# EAGLE schematic ME433Schematic (EAGLE 7.5.0)
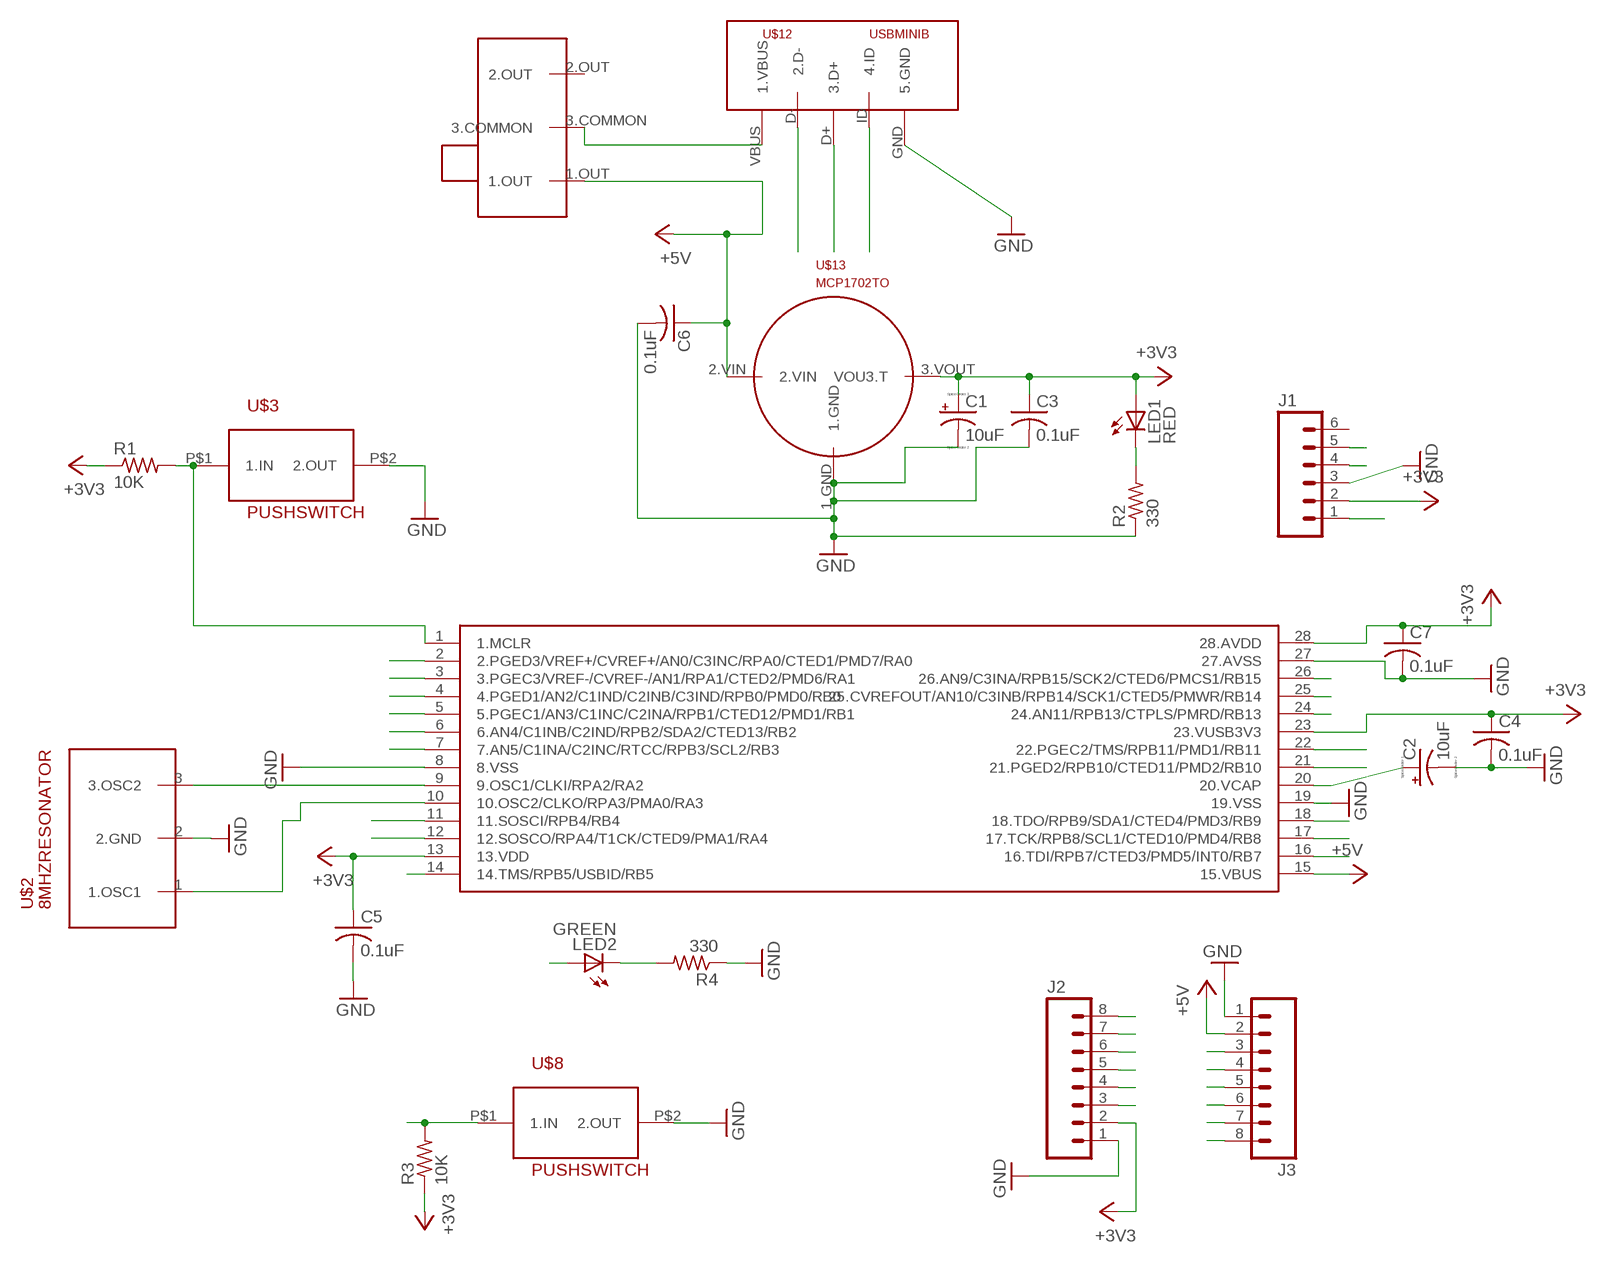
[diagram p0: schematic, sheet 1]

## Parts
C1  10uF  CPOL-USB45181B  [B45181B]
C2  10uF  CPOL-USB45181B  [B45181B]
C3  0.1uF  C-US025-025X050  [C025-025X050]
C4  0.1uF  C-US025-025X050  [C025-025X050]
C5  0.1uF  C-US025-025X050  [C025-025X050]
C6  0.1uF  C-US025-025X050  [C025-025X050]
C7  0.1uF  C-US025-030X050  [C025-030X050]
J1  M06SILK_FEMALE_PTH  [1X06]
J2  M08  [1X08_ROUND]
J3  M08  [1X08_ROUND]
LED1  RED  LED3MM  [LED3MM]
LED2  GREEN  LED3MM  [LED3MM]
R1  10K  R-US_0207/10  [0207/10]
R2  330  R-US_0207/10  [0207/10]
R3  10K  R-US_0207/10  [0207/10]
R4  330  R-US_0207/10  [0207/10]
U$1  PIC32MX250F128B  [DIL28-3]
U$2  8MHZRESONATOR  [1X03]
U$3  PUSHSWITCH  [SWITCH]
U$8  PUSHSWITCH  [SWITCH]
U$12  USBMINIB  [USB-MB-H]
U$13  MCP1702TO  [TO92]
U$18  SLIDESWITCH  [SPDTSLIDE]

## Nets
+3V3: C1.+ C3.1 C4.1 C5.1 C7.1 J1.2 J2.2 LED1.A(1.+) R1.1 R3.1 U$1.13(13.VDD) U$1.23(23.VUSB3V3) U$1.28(28.AVDD) U$13.3.VOUT(VOU3.T)
+5V: C6.1 J3.2 U$1.15(15.VBUS) U$13.2.VIN U$18.1.OUT
A0: J2.8 U$1.2(2.PGED3/VREF+/CVREF+/AN0/C3INC/RPA0/CTED1/PMD7/RA0)
A1: J2.7 U$1.3(3.PGEC3/VREF-/CVREF-/AN1/RPA1/CTED2/PMD6/RA1)
A4: J2.3 LED2.A(1.+) U$1.12(12.SOSCO/RPA4/T1CK/CTED9/PMA1/RA4)
B2: J2.6 U$1.6(6.AN4/C1INB/C2IND/RPB2/SDA2/CTED13/RB2)
B3: J2.5 U$1.7(7.AN5/C1INA/C2INC/RTCC/RPB3/SCL2/RB3)
B4: J2.4 R3.2 U$1.11(11.SOSCI/RPB4/RB4) U$8.P$1(1.IN)
B7: J3.3 U$1.16(16.TDI/RPB7/CTED3/PMD5/INT0/RB7)
B8: J3.4 U$1.17(17.TCK/RPB8/SCL1/CTED10/PMD4/RB8)
B9: J3.5 U$1.18(18.TDO/RPB9/SDA1/CTED4/PMD3/RB9)
B13: J3.6 U$1.24(24.AN11/RPB13/CTPLS/PMRD/RB13)
B14: J3.7 U$1.25(25.CVREFOUT/AN10/C3INB/RPB14/SCK1/CTED5/PMWR/RB14)
B15: J3.8 U$1.26(26.AN9/C3INA/RPB15/SCK2/CTED6/PMCS1/RB15)
D+: U$1.21(21.PGED2/RPB10/CTED11/PMD2/RB10) U$12.D+(3.D+)
D-: U$1.22(22.PGEC2/TMS/RPB11/PMD1/RB11) U$12.D-(2.D-)
GND: C1.- C2.- C3.2 C4.2 C5.2 C6.2 C7.2 J1.3 J2.1 J3.1 R2.1 R4.1 U$1.8(8.VSS) U$1.19(19.VSS) U$1.27(27.AVSS) U$2.2(2.GND) U$3.P$2(2.OUT) U$8.P$2(2.OUT) U$12.GND(5.GND) U$13.1.GND
ID: U$1.14(14.TMS/RPB5/USBID/RB5) U$12.ID(4.ID)
MCLR: J1.1 R1.2 U$1.1(1.MCLR) U$3.P$1(1.IN)
N$1: U$12.VBUS(1.VBUS) U$18.3.COMMON
N$2: U$1.9(9.OSC1/CLKI/RPA2/RA2) U$2.3(3.OSC2)
N$3: U$1.10(10.OSC2/CLKO/RPA3/PMA0/RA3) U$2.1(1.OSC1)
N$6: C2.+ U$1.20(20.VCAP)
N$7: LED2.K(2.-) R4.2
N$11: LED1.K(2.-) R2.2
PEGC1: J1.5 U$1.5(5.PGEC1/AN3/C1INC/C2INA/RPB1/CTED12/PMD1/RB1)
PEGD1: J1.4 U$1.4(4.PGED1/AN2/C1IND/C2INB/C3IND/RPB0/PMD0/RB0)
Unconnected: J1.6 U$18.2.OUT

## Library data of the parts
C1 C2 = ME433Library:CPOL-US: POLARIZED CAPACITOR, American symbol
C3-C7 = ME433Library:C-US: CAPACITOR, American symbol
J1 = ME433Library:M06: Header 6 Standard 6-pin 0.1" header. Use with straight break away headers (SKU : PRT-00116), right angle break away headers (PRT-00553), swiss pins (PRT-00743), machine pins (PRT-00117), and female headers (PRT-00115). Molex polarized connector foot print use with SKU : PRT-08094 with associated crimp pins and housings. NOTES ON THE VARIANTS LOCK and LOCK_LONGPADS... This footprint was designed to help hold the alignment of a through-hole component (i.e. 6-pin header) while soldering it into place. You may notice that each hole has been shifted either up or down by 0.005 of an inch from it's more standard position (which is a perfectly straight line). This slight alteration caused the pins (the squares in the middle) to touch the edges of the holes. Because they are alternating, it causes a "brace" to hold the component in place. 0.005 has proven to be the perfect amount of "off-center" position when using our standard breakaway headers. Although looks a little odd when you look at the bare footprint, once you have a header in there, the alteration is very hard to notice. Also,if you push a header all the way into place, it is covered up entirely on the bottom side. This idea of altering the position of holes to aid alignment will be further integrated into the Sparkfun Library for other footprints. It can help hold any component with 3 or more connection pins.; PROD_ID: CONN-08437
J2 J3 = ME433Library:M08: Header 8 Standard 8-pin 0.1" header. Use with straight break away headers (SKU : PRT-00116), right angle break away headers (PRT-00553), swiss pins (PRT-00743), machine pins (PRT-00117), and female headers (PRT-00115).; PROD_ID: CONN-08437
LED1 LED2 = ME433Library:LED: LED OSRAM: - CHIPLED LG R971, LG N971, LY N971, LG Q971, LY Q971, LO R971, LY R971 LH N974, LH R974 LS Q976, LO Q976, LY Q976 LO Q996 - Hyper CHIPLED LW Q18S LB Q993, LB Q99A, LB R99A - SideLED LS A670, LO A670, LY A670, LG A670, LP A670 LB A673, LV A673, LT A673, LW A673 LH A674 LY A675 LS A676, LA A676, LO A676, LY A676, LW A676 LS A679, LY A679, LG A679 - Hyper Micro SIDELED® LS Y876, LA Y876, LO Y876, LY Y876 LT Y87S - SmartLED LW L88C, LW L88S LB L89C, LB L89S, LG L890 LS L89K, LO L89K, LY L89K LS L896, LA L896, LO L896, LY L896 - TOPLED LS T670, LO T670, LY T670, LG T670, LP T670 LSG T670, LSP T670, LSY T670, LOP T670, LYG T670 LG T671, LOG T671, LSG T671 LB T673, LV T673, LT T673, LW T673 LH T674 LS T676, LA T676, LO T676, LY T676, LB T676, LH T676, LSB T676, LW T676 LB T67C, LV T67C, LT T67C, LS T67K, LO T67K, LY T67K, LW E67C LS E67B, LA E67B, LO E67B, LY E67B, LB E67C, LV E67C, LT E67C LW T67C LS T679, LY T679, LG T679 LS T770, LO T770, LY T770, LG T770, LP T770 LB T773, LV T773, LT T773, LW T773 LH T774 LS E675, LA E675, LY E675, LS T675 LS T776, LA T776, LO T776, LY T776, LB T776 LHGB T686 LT T68C, LB T68C - Hyper Mini TOPLED® LB M676 - Mini TOPLED Santana® LG M470 LS M47K, LO M47K, LY M47K Source: http://www.osram.convergy.de LUXEON: - LUMILED® LXK2-PW12-R00, LXK2-PW12-S00, LXK2-PW14-U00, LXK2-PW14-V00 LXK2-PM12-R00, LXK2-PM12-S00, LXK2-PM14-U00 LXK2-PE12-Q00, LXK2-PE12-R00, LXK2-PE12-S00, LXK2-PE14-T00, LXK2-PE14-U00 LXK2-PB12-K00, LXK2-PB12-L00, LXK2-PB12-M00, LXK2-PB14-N00, LXK2-PB14-P00, LXK2-PB14-Q00 LXK2-PR12-L00, LXK2-PR12-M00, LXK2-PR14-Q00, LXK2-PR14-R00 LXK2-PD12-Q00, LXK2-PD12-R00, LXK2-PD12-S00 LXK2-PH12-R00, LXK2-PH12-S00 LXK2-PL12-P00, LXK2-PL12-Q00, LXK2-PL12-R00 Source: www.luxeon.com KINGBRIGHT: KA-3528ASYC Source: www.kingbright.com
R1-R4 = ME433Library:R-US_: RESISTOR, American symbol
U$1 = ME433Library:PIC32MX250F128B
U$2 = ME433Library:8MHZRESONATOR
U$3 U$8 = ME433Library:PUSHSWITCH
U$12 = ME433Library:USBMINIB
U$13 = ME433Library:MCP1702
U$18 = ME433Library:SLIDESWITCH